# EAGLE design filter2 (EAGLE 7.7.0)
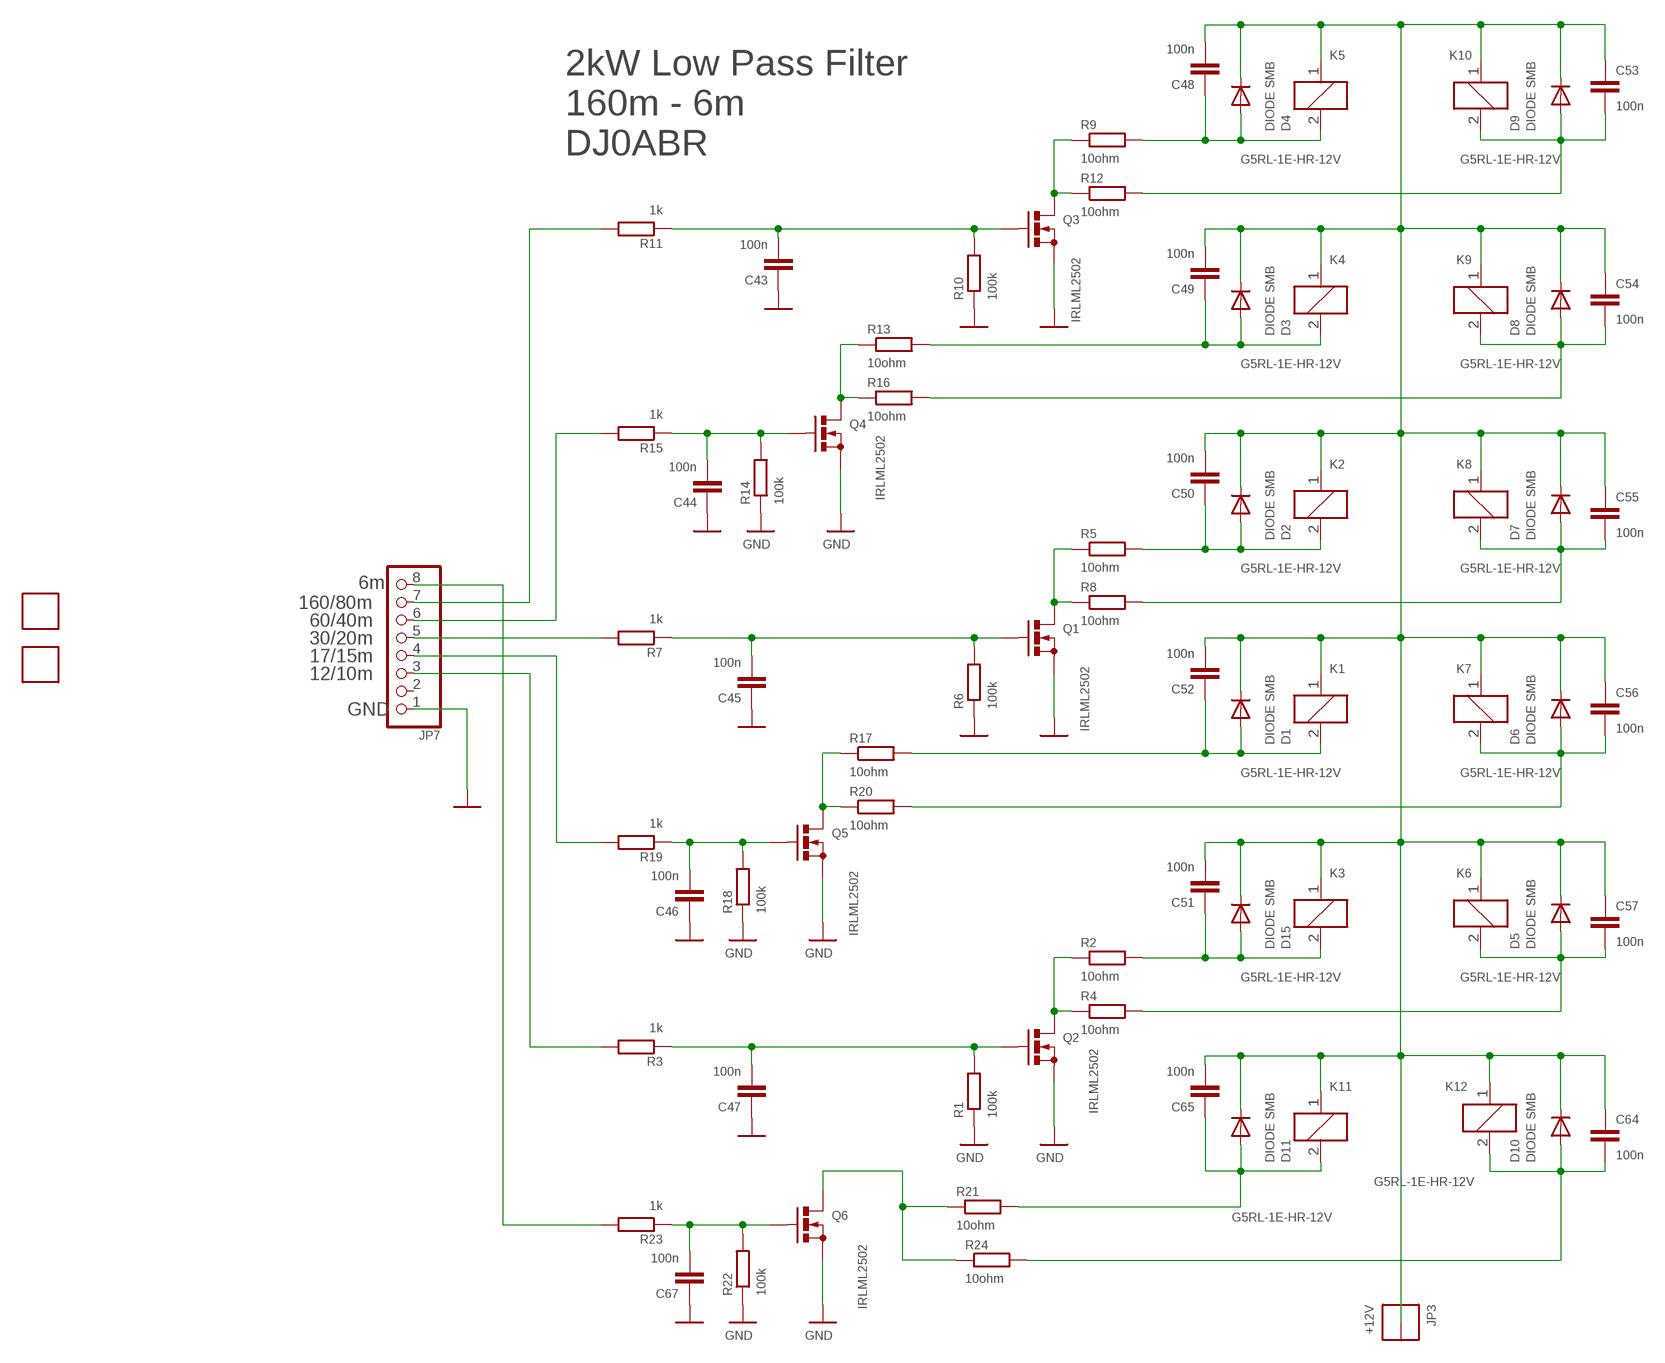
[diagram p0: schematic, sheet 1, part 1 of 2]
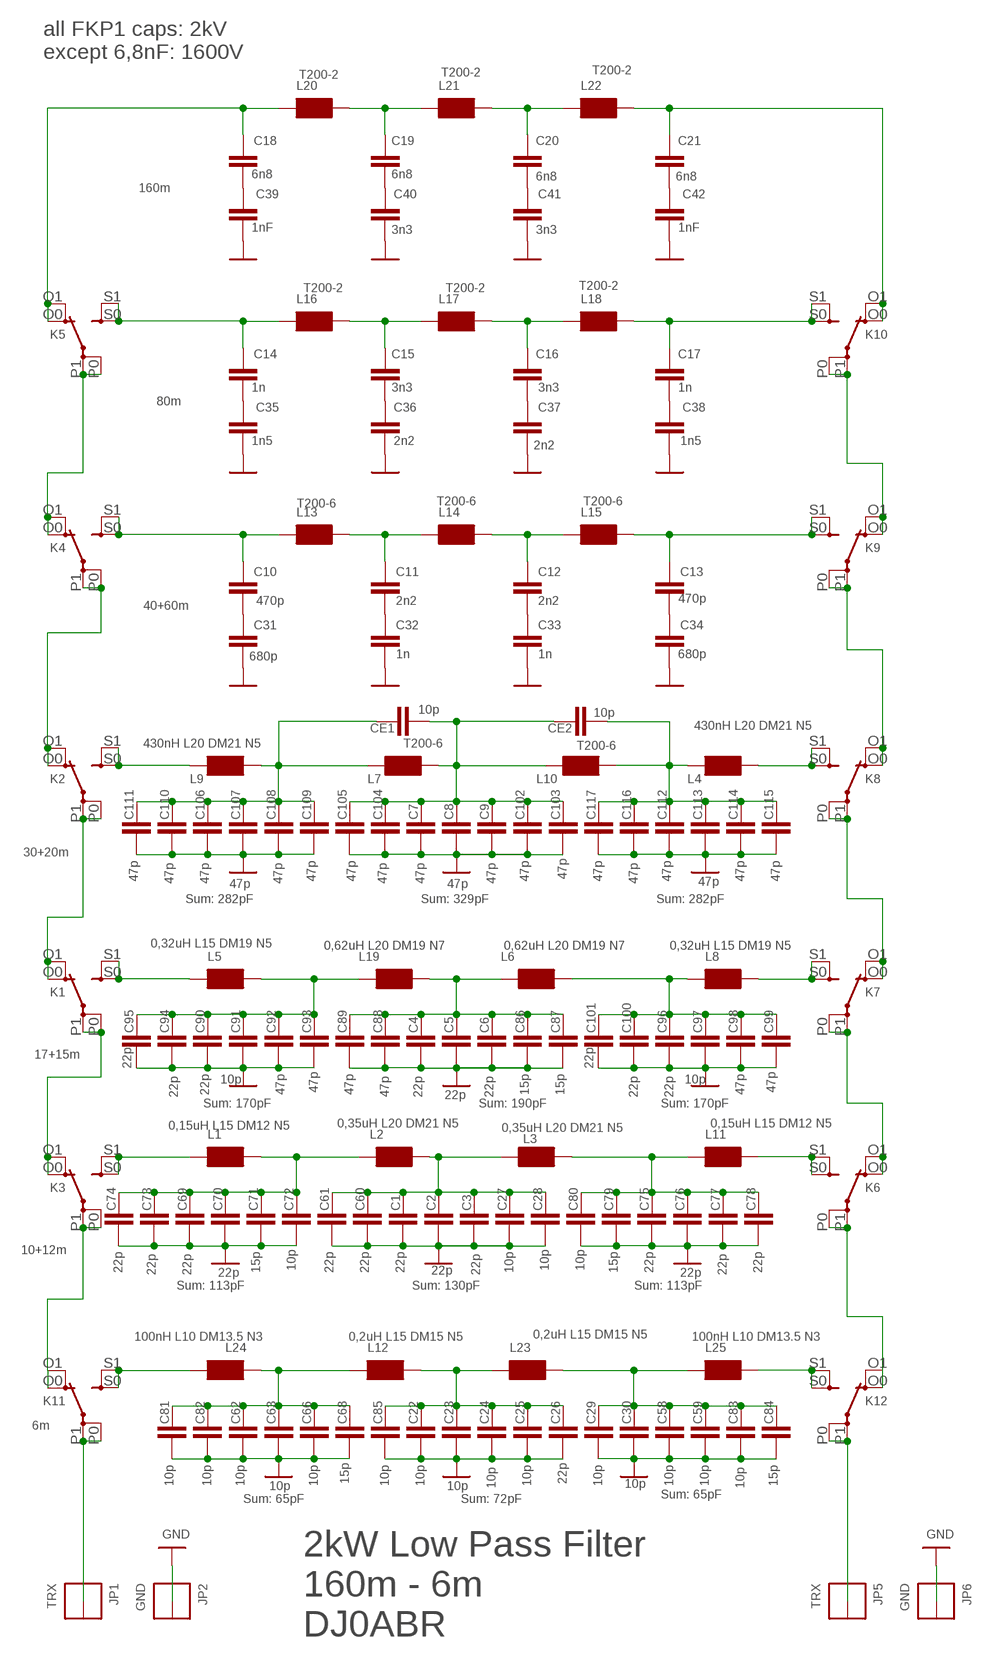
[diagram p1: schematic, sheet 1, part 2 of 2]

## Parts
C1  22p  C-EUC1812K  [C1812K]
C2  22p  C-EUC1812K  [C1812K]
C3  22p  C-EUC1812K  [C1812K]
C4  22p  C-EUC1812K  [C1812K]
C5  22p  C-EUC1812K  [C1812K]
C6  22p  C-EUC1812K  [C1812K]
C7  47p  C-EUC1812K  [C1812K]
C8  47p  C-EUC1812K  [C1812K]
C9  47p  C-EUC1812K  [C1812K]
C10  470p  C-EU150-064X183  [C150-064X183]
C11  2n2  C-EU225-074X268  [C225-074X268]
C12  2n2  C-EU225-074X268  [C225-074X268]
C13  470p  C-EU150-064X183  [C150-064X183]
C14  1n  C-EU225-062X268  [C225-062X268]
C15  3n3  C-EU225-074X268  [C225-074X268]
C16  3n3  C-EU225-074X268  [C225-074X268]
C17  1n  C-EU225-062X268  [C225-062X268]
C18  6n8  C-EU225-074X268  [C225-074X268]
C19  6n8  C-EU225-074X268  [C225-074X268]
C20  6n8  C-EU225-074X268  [C225-074X268]
C21  6n8  C-EU225-074X268  [C225-074X268]
C22  10p  C-EUC1812K  [C1812K]
C23  10p  C-EUC1812K  [C1812K]
C24  10p  C-EUC1812K  [C1812K]
C25  10p  C-EUC1812K  [C1812K]
C26  22p  C-EUC1812K  [C1812K]
C27  10p  C-EUC1812K  [C1812K]
C28  10p  C-EUC1812K  [C1812K]
C29  10p  C-EUC1812K  [C1812K]
C30  10p  C-EUC1812K  [C1812K]
C31  680p  C-EU150-064X183  [C150-064X183]
C32  1n  C-EU225-062X268  [C225-062X268]
C33  1n  C-EU225-062X268  [C225-062X268]
C34  680p  C-EU150-064X183  [C150-064X183]
C35  1n5  C-EU225-074X268  [C225-074X268]
C36  2n2  C-EU225-074X268  [C225-074X268]
C37  2n2  C-EU225-074X268  [C225-074X268]
C38  1n5  C-EU225-074X268  [C225-074X268]
C39  1nF  C-EU225-074X268  [C225-074X268]
C40  3n3  C-EU225-087X268  [C225-087X268]
C41  3n3  C-EU225-087X268  [C225-087X268]
C42  1nF  C-EU225-074X268  [C225-074X268]
C43  100n  C-EUC0603K  [C0603K]
C44  100n  C-EUC0603K  [C0603K]
C45  100n  C-EUC0603K  [C0603K]
C46  100n  C-EUC0603K  [C0603K]
C47  100n  C-EUC0603K  [C0603K]
C48  100n  C-EUC0603K  [C0603K]
C49  100n  C-EUC0603K  [C0603K]
C50  100n  C-EUC0603K  [C0603K]
C51  100n  C-EUC0603K  [C0603K]
C52  100n  C-EUC0603K  [C0603K]
C53  100n  C-EUC0603K  [C0603K]
C54  100n  C-EUC0603K  [C0603K]
C55  100n  C-EUC0603K  [C0603K]
C56  100n  C-EUC0603K  [C0603K]
C57  100n  C-EUC0603K  [C0603K]
C58  10p  C-EUC1812K  [C1812K]
C59  10p  C-EUC1812K  [C1812K]
C60  22p  C-EUC1812K  [C1812K]
C61  22p  C-EUC1812K  [C1812K]
C62  10p  C-EUC1812K  [C1812K]
C63  10p  C-EUC1812K  [C1812K]
C64  100n  C-EUC0603K  [C0603K]
C65  100n  C-EUC0603K  [C0603K]
C66  10p  C-EUC1812K  [C1812K]
C67  100n  C-EUC0603K  [C0603K]
C68  15p  C-EUC1812K  [C1812K]
C69  22p  C-EUC1812K  [C1812K]
C70  22p  C-EUC1812K  [C1812K]
C71  15p  C-EUC1812K  [C1812K]
C72  10p  C-EUC1812K  [C1812K]
C73  22p  C-EUC1812K  [C1812K]
C74  22p  C-EUC1812K  [C1812K]
C75  22p  C-EUC1812K  [C1812K]
C76  22p  C-EUC1812K  [C1812K]
C77  22p  C-EUC1812K  [C1812K]
C78  22p  C-EUC1812K  [C1812K]
C79  15p  C-EUC1812K  [C1812K]
C80  10p  C-EUC1812K  [C1812K]
C81  10p  C-EUC1812K  [C1812K]
C82  10p  C-EUC1812K  [C1812K]
C83  10p  C-EUC1812K  [C1812K]
C84  15p  C-EUC1812K  [C1812K]
C85  10p  C-EUC1812K  [C1812K]
C86  15p  C-EUC1812K  [C1812K]
C87  15p  C-EUC1812K  [C1812K]
C88  47p  C-EUC1812K  [C1812K]
C89  47p  C-EUC1812K  [C1812K]
C90  22p  C-EUC1812K  [C1812K]
C91  10p  C-EUC1812K  [C1812K]
C92  47p  C-EUC1812K  [C1812K]
C93  47p  C-EUC1812K  [C1812K]
C94  22p  C-EUC1812K  [C1812K]
C95  22p  C-EUC1812K  [C1812K]
C96  22p  C-EUC1812K  [C1812K]
C97  10p  C-EUC1812K  [C1812K]
C98  47p  C-EUC1812K  [C1812K]
C99  47p  C-EUC1812K  [C1812K]
C100  22p  C-EUC1812K  [C1812K]
C101  22p  C-EUC1812K  [C1812K]
C102  47p  C-EUC1812K  [C1812K]
C103  47p  C-EUC1812K  [C1812K]
C104  47p  C-EUC1812K  [C1812K]
C105  47p  C-EUC1812K  [C1812K]
C106  47p  C-EUC1812K  [C1812K]
C107  47p  C-EUC1812K  [C1812K]
C108  47p  C-EUC1812K  [C1812K]
C109  47p  C-EUC1812K  [C1812K]
C110  47p  C-EUC1812K  [C1812K]
C111  47p  C-EUC1812K  [C1812K]
C112  47p  C-EUC1812K  [C1812K]
C113  47p  C-EUC1812K  [C1812K]
C114  47p  C-EUC1812K  [C1812K]
C115  47p  C-EUC1812K  [C1812K]
C116  47p  C-EUC1812K  [C1812K]
C117  47p  C-EUC1812K  [C1812K]
CE1  10p  C-EUC1812K  [C1812K]
CE2  10p  C-EUC1812K  [C1812K]
D1  DIODE SMB  DIODE-SMB  [SMB]
D2  DIODE SMB  DIODE-SMB  [SMB]
D3  DIODE SMB  DIODE-SMB  [SMB]
D4  DIODE SMB  DIODE-SMB  [SMB]
D5  DIODE SMB  DIODE-SMB  [SMB]
D6  DIODE SMB  DIODE-SMB  [SMB]
D7  DIODE SMB  DIODE-SMB  [SMB]
D8  DIODE SMB  DIODE-SMB  [SMB]
D9  DIODE SMB  DIODE-SMB  [SMB]
D10  DIODE SMB  DIODE-SMB  [SMB]
D11  DIODE SMB  DIODE-SMB  [SMB]
D15  DIODE SMB  DIODE-SMB  [SMB]
FID1  FIDUCIAL  [FIDUCIAL]
FID2  FIDUCIAL  [FIDUCIAL]
JP1  TRX  THICKPINSQUARE  [THICKPIN]
JP2  GND  THICKPINSQUARE  [THICKPIN]
JP3  +12V  THICKPINSQUARE  [THICKPIN]
JP5  TRX  THICKPINSQUARE  [THICKPIN]
JP6  GND  THICKPINSQUARE  [THICKPIN]
JP7  PINHD-1X8  [1X08]
K1  G5RL-1E-HR-12V  G2RE  [G2RE]
K2  G5RL-1E-HR-12V  G2RE  [G2RE]
K3  G5RL-1E-HR-12V  G2RE  [G2RE]
K4  G5RL-1E-HR-12V  G2RE  [G2RE]
K5  G5RL-1E-HR-12V  G2RE  [G2RE]
K6  G5RL-1E-HR-12V  G2RE  [G2RE]
K7  G5RL-1E-HR-12V  G2RE  [G2RE]
K8  G5RL-1E-HR-12V  G2RE  [G2RE]
K9  G5RL-1E-HR-12V  G2RE  [G2RE]
K10  G5RL-1E-HR-12V  G2RE  [G2RE]
K11  G5RL-1E-HR-12V  G2RE  [G2RE]
K12  G5RL-1E-HR-12V  G2RE  [G2RE]
L1  0,15uH L15 DM12 N5  LL15X14  [LUFTSPULE_L15XDM14]
L2  0,35uH L20 DM21 N5  LL17X20  [LUFTSPULE_L17XDM20]
L3  0,35uH L20 DM21 N5  LL17X20  [LUFTSPULE_L17XDM20]
L4  430nH L20 DM21 N5  L20X20  [LUFTSPULE_20X20RM20]
L5  0,32uH L15 DM19 N5  LL15X20  [LUFTSPULR_L15XDM20]
L6  0,62uH L20 DM19 N7  L20X20  [LUFTSPULE_20X20RM20]
L7  T200-6  LT200  [KERN200_STEHEND_2PIN]
L8  0,32uH L15 DM19 N5  LL15X20  [LUFTSPULR_L15XDM20]
L9  430nH L20 DM21 N5  L20X20  [LUFTSPULE_20X20RM20]
L10  T200-6  LT200  [KERN200_STEHEND_2PIN]
L11  0,15uH L15 DM12 N5  LL15X14  [LUFTSPULE_L15XDM14]
L12  0,2uH L15 DM15 N5  LL15X14  [LUFTSPULE_L15XDM14]
L13  T200-6  LT200  [KERN200_STEHEND_2PIN]
L14  T200-6  LT200  [KERN200_STEHEND_2PIN]
L15  T200-6  LT200  [KERN200_STEHEND_2PIN]
L16  T200-2  LT200  [KERN200_STEHEND_2PIN]
L17  T200-2  LT200  [KERN200_STEHEND_2PIN]
L18  T200-2  LT200  [KERN200_STEHEND_2PIN]
L19  0,62uH L20 DM19 N7  L20X20  [LUFTSPULE_20X20RM20]
L20  T200-2  LT200  [KERN200_STEHEND_2PIN]
L21  T200-2  LT200  [KERN200_STEHEND_2PIN]
L22  T200-2  LT200  [KERN200_STEHEND_2PIN]
L23  0,2uH L15 DM15 N5  LL15X14  [LUFTSPULE_L15XDM14]
L24  100nH L10 DM13.5 N3  L  [LUFTSPULE_10X13K5]
L25  100nH L10 DM13.5 N3  L  [LUFTSPULE_10X13K5]
Q1  IRLML2502  BS170_SMD  [SOT23]
Q2  IRLML2502  BS170_SMD  [SOT23]
Q3  IRLML2502  BS170_SMD  [SOT23]
Q4  IRLML2502  BS170_SMD  [SOT23]
Q5  IRLML2502  BS170_SMD  [SOT23]
Q6  IRLML2502  BS170_SMD  [SOT23]
R1  100k  R-EU_R0603  [R0603]
R2  10ohm  R-EU_R0603  [R0603]
R3  1k  R-EU_R0603  [R0603]
R4  10ohm  R-EU_R0603  [R0603]
R5  10ohm  R-EU_R0603  [R0603]
R6  100k  R-EU_R0603  [R0603]
R7  1k  R-EU_R0603  [R0603]
R8  10ohm  R-EU_R0603  [R0603]
R9  10ohm  R-EU_R0603  [R0603]
R10  100k  R-EU_R0603  [R0603]
R11  1k  R-EU_R0603  [R0603]
R12  10ohm  R-EU_R0603  [R0603]
R13  10ohm  R-EU_R0603  [R0603]
R14  100k  R-EU_R0603  [R0603]
R15  1k  R-EU_R0603  [R0603]
R16  10ohm  R-EU_R0603  [R0603]
R17  10ohm  R-EU_R0603  [R0603]
R18  100k  R-EU_R0603  [R0603]
R19  1k  R-EU_R0603  [R0603]
R20  10ohm  R-EU_R0603  [R0603]
R21  10ohm  R-EU_R0603  [R0603]
R22  100k  R-EU_R0603  [R0603]
R23  1k  R-EU_R0603  [R0603]
R24  10ohm  R-EU_R0603  [R0603]

## Nets
+12V [ub]: C48.2 C49.2 C50.2 C51.2 C52.2 C53.1 C54.1 C55.1 C56.1 C57.1 C64.1 C65.2 D1.C D2.C D3.C D4.C D5.C D6.C D7.C D8.C D9.C D10.C D11.C D15.C JP3.1 K1.1 K2.1 K3.1 K4.1 K5.1 K6.1 K7.1 K8.1 K9.1 K10.1 K11.1 K12.1
GND: C1.2 C2.2 C3.2 C4.2 C5.2 C6.2 C7.2 C8.2 C9.2 C22.2 C23.2 C24.2 C25.2 C26.2 C27.2 C28.2 C29.2 C30.2 C31.2 C32.2 C33.2 C34.2 C35.2 C36.2 C37.2 C38.2 C39.2 C40.2 C41.2 C42.2 C43.1 C44.1 C45.1 C46.1 C47.1 C58.2 C59.2 C60.2 C61.2 C62.2 C63.2 C66.2 C67.1 C68.2 C69.2 C70.2 C71.2 C72.2 C73.2 C74.2 C75.2 C76.2 C77.2 C78.2 C79.2 C80.2 C81.2 C82.2 C83.2 C84.2 C85.2 C86.2 C87.2 C88.2 C89.2 C90.2 C91.2 C92.2 C93.2 C94.2 C95.2 C96.2 C97.2 C98.2 C99.2 C100.2 C101.2 C102.2 C103.2 C104.2 C105.2 C106.2 C107.2 C108.2 C109.2 C110.2 C111.2 C112.2 C113.2 C114.2 C115.2 C116.2 C117.2 JP2.1 JP6.1 JP7.1 Q1.2(S) Q2.2(S) Q3.2(S) Q4.2(S) Q5.2(S) Q6.2(S) R1.1 R6.1 R10.1 R14.1 R18.1 R22.1 ; supply symbol labelled 
N$1: K6.P0(2:P) K6.P1(2:P) K12.O0(2:O) K12.O1(2:O)
N$2: K3.S0(2:S) K3.S1(2:S) L1.P$1
N$3: K1.P0(2:P) K1.P1(2:P) K3.O0(2:O) K3.O1(2:O)
N$4: C75.1 C76.1 C77.1 C78.1 C79.1 C80.1 L3.P$2 L11.P$1
N$5: K1.S0(2:S) K1.S1(2:S) L5.P$1
N$6: K1.O0(2:O) K1.O1(2:O) K2.P0(2:P) K2.P1(2:P)
N$7: C1.1 C2.1 C3.1 C27.1 C28.1 C60.1 C61.1 L2.P$2 L3.P$1
N$8: K2.S0(2:S) K2.S1(2:S) L9.P$1
N$9: K2.O0(2:O) K2.O1(2:O) K4.P0(2:P) K4.P1(2:P)
N$10: K8.S0(2:S) K8.S1(2:S) L4.P$2
N$11: K4.O0(2:O) K4.O1(2:O) K5.P0(2:P) K5.P1(2:P)
N$12: C106.1 C107.1 C108.1 C109.1 C110.1 C111.1 CE1.1 L7.1 L9.P$2
N$13: K7.S0(2:S) K7.S1(2:S) L8.P$2
N$14: Q2.3(D) R2.1 R4.1
N$15: K6.S0(2:S) K6.S1(2:S) L11.P$2
N$17: K6.O0(2:O) K6.O1(2:O) K7.P0(2:P) K7.P1(2:P)
N$18: K7.O0(2:O) K7.O1(2:O) K8.P0(2:P) K8.P1(2:P)
N$19: K8.O0(2:O) K8.O1(2:O) K9.P0(2:P) K9.P1(2:P)
N$20: K9.O0(2:O) K9.O1(2:O) K10.P0(2:P) K10.P1(2:P)
N$21: C47.2 Q2.1(G) R1.2 R3.1
N$22: C90.1 C91.1 C92.1 C93.1 C94.1 C95.1 L5.P$2 L19.P$1
N$23: C4.1 C5.1 C6.1 C86.1 C87.1 C88.1 C89.1 L6.P$1 L19.P$2
N$24: C96.1 C97.1 C98.1 C99.1 C100.1 C101.1 L6.P$2 L8.P$1
N$25: C18.1 K5.O0(2:O) K5.O1(2:O) L20.1
N$26: C7.1 C8.1 C9.1 C102.1 C103.1 C104.1 C105.1 CE1.2 CE2.1 L7.2 L10.1
N$27: C112.1 C113.1 C114.1 C115.1 C116.1 C117.1 CE2.2 L4.P$1 L10.2
N$28: C10.1 K4.S0(2:S) K4.S1(2:S) L13.1
N$29: C11.1 L13.2 L14.1
N$30: C12.1 L14.2 L15.1
N$31: C13.1 K9.S0(2:S) K9.S1(2:S) L15.2
N$32: C14.1 K5.S0(2:S) K5.S1(2:S) L16.1
N$33: C15.1 L16.2 L17.1
N$34: C16.1 L17.2 L18.1
N$35: C17.1 K10.S0(2:S) K10.S1(2:S) L18.2
N$36: K3.P0(2:P) K3.P1(2:P) K11.O0(2:O) K11.O1(2:O)
N$37: C19.1 L20.2 L21.1
N$38: C20.1 L21.2 L22.1
N$40: Q1.3(D) R5.1 R8.1
N$41: C45.2 Q1.1(G) R6.2 R7.1
N$42: Q3.3(D) R9.1 R12.1
N$43: C43.2 Q3.1(G) R10.2 R11.1
N$44: Q4.3(D) R13.1 R16.1
N$45: C44.2 Q4.1(G) R14.2 R15.1
N$46: Q5.3(D) R17.1 R20.1
N$47: C46.2 Q5.1(G) R18.2 R19.1
N$48: JP7.5 R7.2
N$49: JP7.6 R15.2
N$50: JP7.7 R11.2
N$51: C22.1 C23.1 C24.1 C25.1 C26.1 C85.1 L12.P$2 L23.P$1
N$52: C21.1 K10.O0(2:O) K10.O1(2:O) L22.2
N$53: C69.1 C70.1 C71.1 C72.1 C73.1 C74.1 L1.P$2 L2.P$1
N$54: C13.2 C34.1
N$55: C21.2 C42.1
N$56: C20.2 C41.1
N$57: C19.2 C40.1
N$58: C18.2 C39.1
N$61: C10.2 C31.1
N$62: C11.2 C32.1
N$63: C12.2 C33.1
N$64: C17.2 C38.1
N$65: C16.2 C37.1
N$66: C15.2 C36.1
N$67: C14.2 C35.1
N$72: JP7.4 R19.2
N$73: JP7.3 R3.2
N$74: JP1.1 K11.P0(2:P) K11.P1(2:P)
N$75: K11.S0(2:S) K11.S1(2:S) L24.P$1
N$76: Q6.3(D) R21.1 R24.1
N$77: C62.1 C63.1 C66.1 C68.1 C81.1 C82.1 L12.P$1 L24.P$2
N$79: C29.1 C30.1 C58.1 C59.1 C83.1 C84.1 L23.P$2 L25.P$1
N$80: K12.S0(2:S) K12.S1(2:S) L25.P$2
N$81: JP5.1 K12.P0(2:P) K12.P1(2:P)
N$82: C67.2 Q6.1(G) R22.2 R23.1
N$86: JP7.8 R23.2
R1: C50.1 D2.A K2.2 R5.2
R2: C51.1 D15.A K3.2 R2.2
R3: C52.1 D1.A K1.2 R17.2
R4: C65.1 D11.A K11.2 R21.2
R5: C49.1 D3.A K4.2 R13.2
R8: C48.1 D4.A K5.2 R9.2
RB6: C64.2 D10.A K12.2 R24.2
RB10: C57.2 D5.A K6.2 R4.2
RB15: C56.2 D6.A K7.2 R20.2
RB20: C55.2 D7.A K8.2 R8.2
RB40: C54.2 D8.A K9.2 R16.2
RB80: C53.2 D9.A K10.2 R12.2
Unconnected: FID1.P$1 FID2.P$1 JP7.2

## Notes on the sheet
- all FKP1 caps: 2kV
  except 6,8nF: 1600V
- 160m
- 2kW Low Pass Filter
  160m - 6m
  DJ0ABR
- 80m
- 40+60m
- 6m
- 160/80m
- 30+20m
- 60/40m
- 30/20m
- 17/15m | Sum: 282pF | Sum: 329pF | Sum: 282pF
- 12/10m
- GND
- 17+15m
- Sum: 170pF | Sum: 190pF | Sum: 170pF
- 10+12m
- Sum: 113pF | Sum: 130pF | Sum: 113pF
- 6m
- Sum: 65pF
- Sum: 65pF | Sum: 72pF
- 2kW Low Pass Filter
  160m - 6m
  DJ0ABR

## Library data of the parts
C1-C117 CE1 CE2 = rcl:C-EU: CAPACITOR, European symbol
D1-D11 D15 = diode:DIODE-: DIODE
FID1 FID2 = km:FIDUCIAL
JP1-JP3 JP5 JP6 = km:THICKPIN
JP7 = pinhead:PINHD-1X8: PIN HEADER
K1-K12 = relay:G2RE: RELAY 1 x switch, high current, Omron; OC_FARNELL: unknown; OC_NEWARK: unknown
L1-L25 = km_HF:L
Q1-Q6 = km:BS170_: N-CHANNEL MOS FET
R1-R24 = rcl:R-EU_: RESISTOR, European symbol

## Net classes
1 ub: width 0.61 mm

## Board
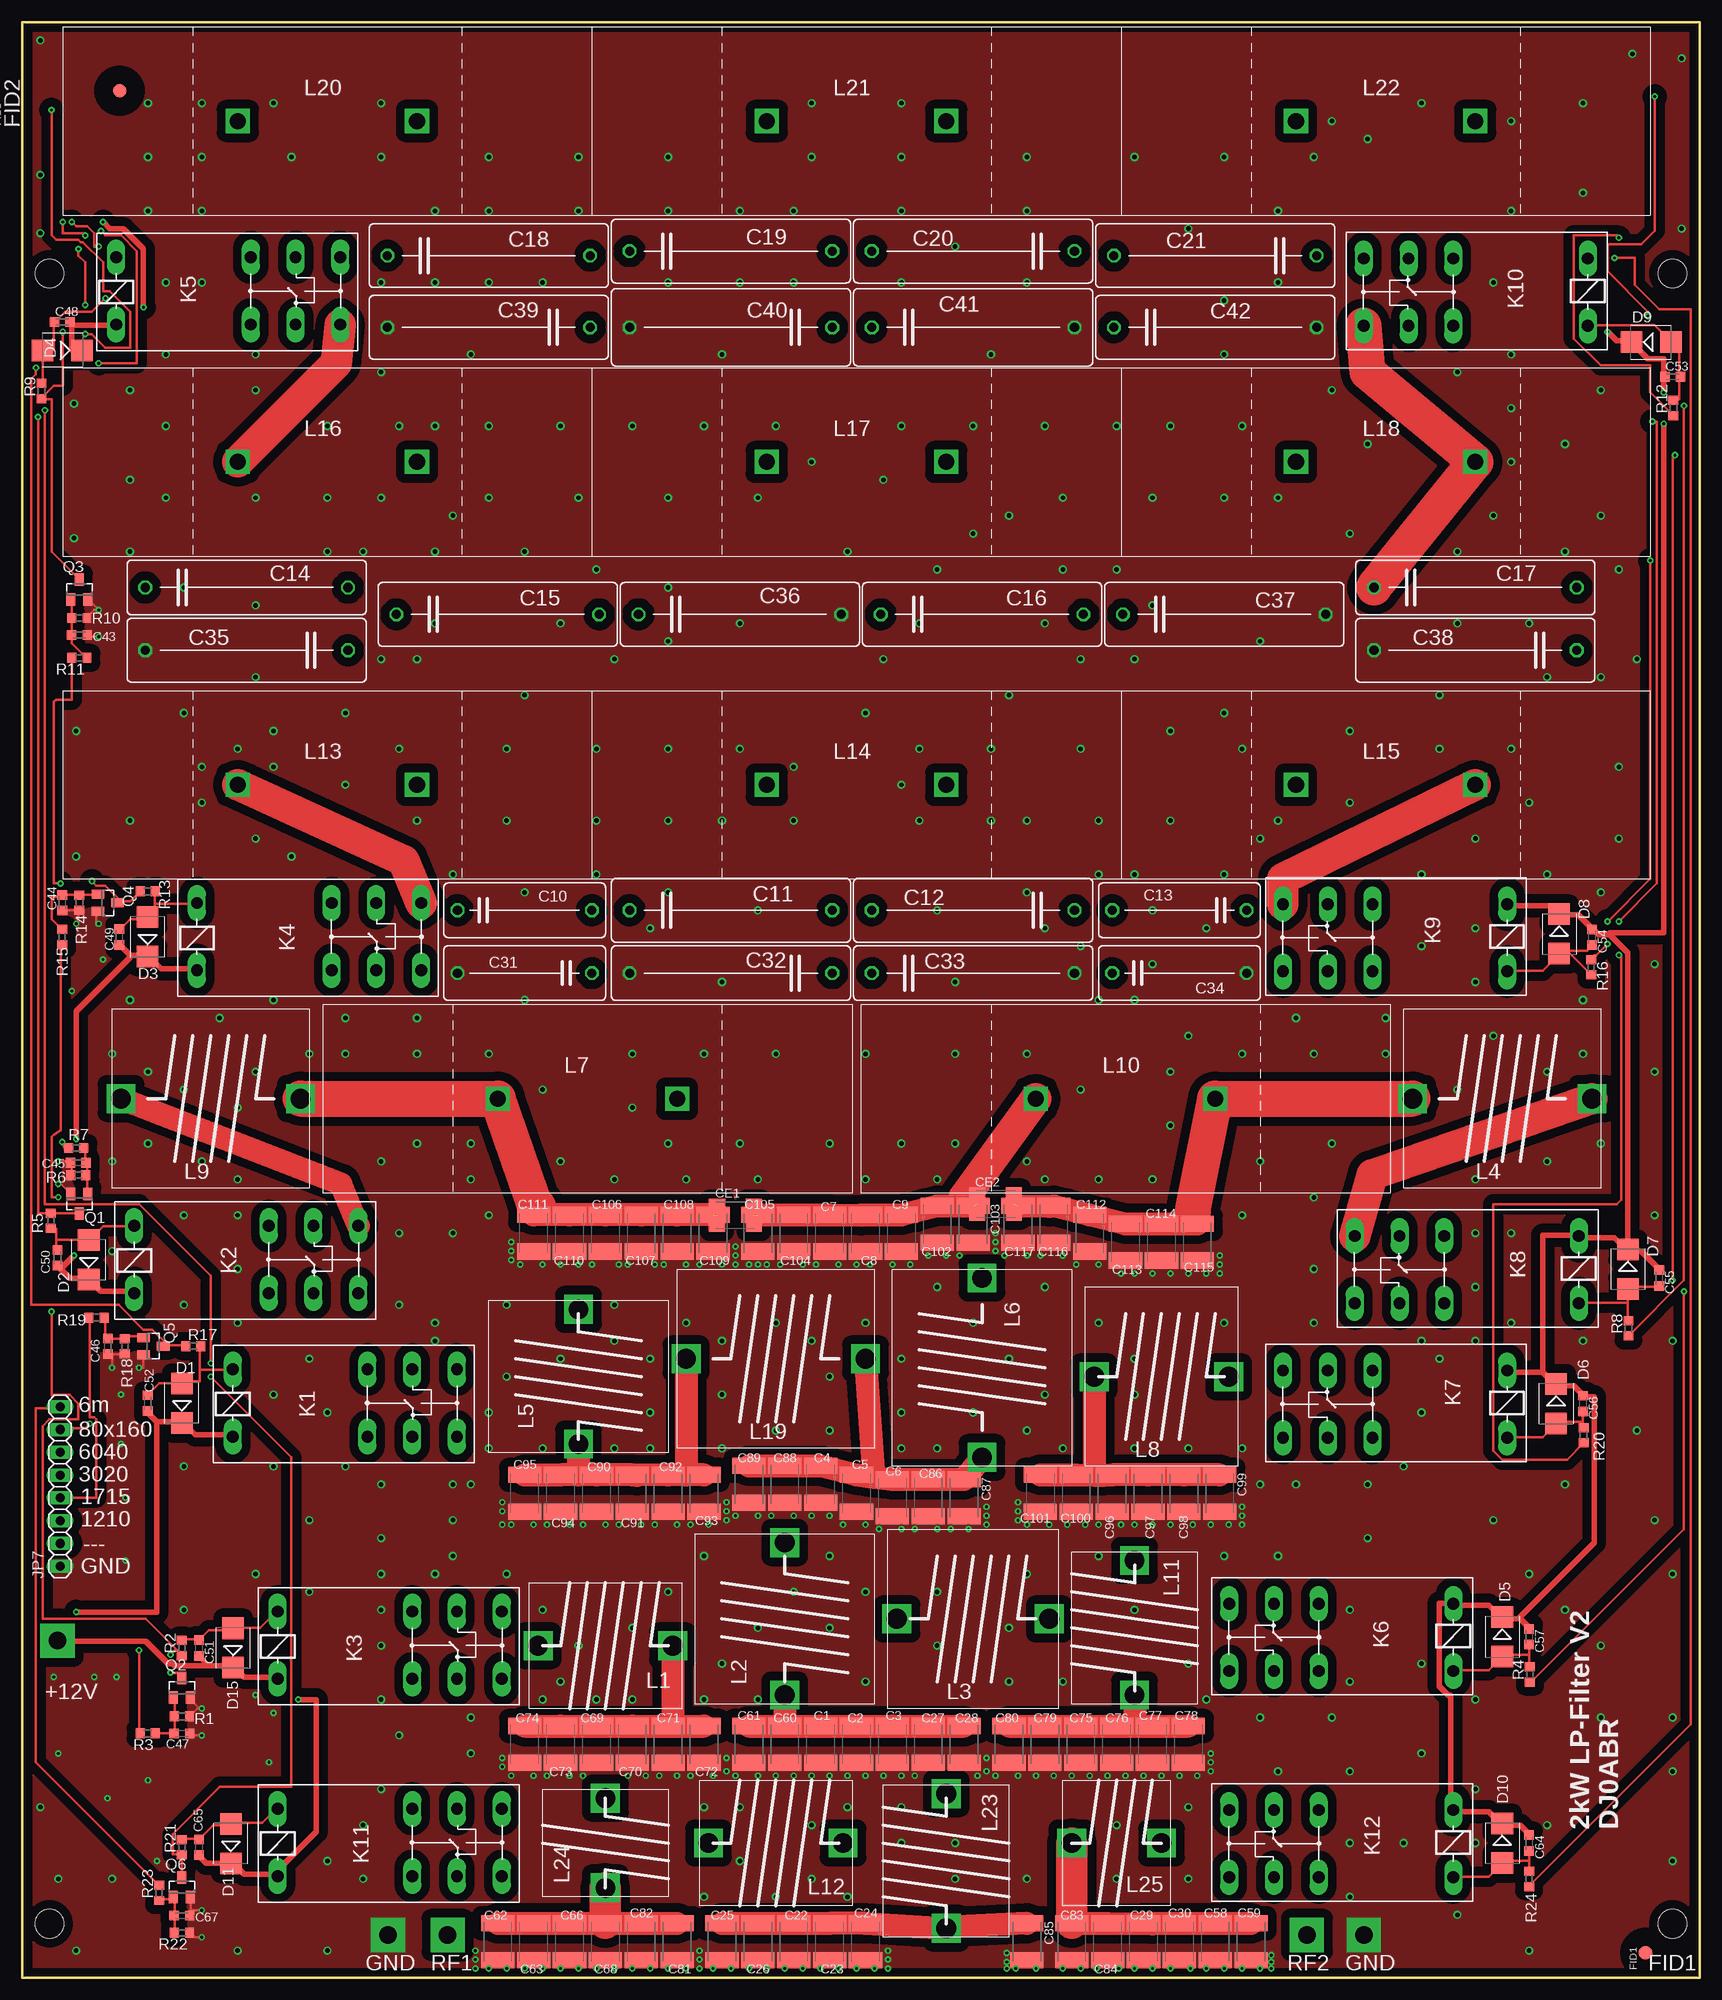
[diagram p2: board, top side]
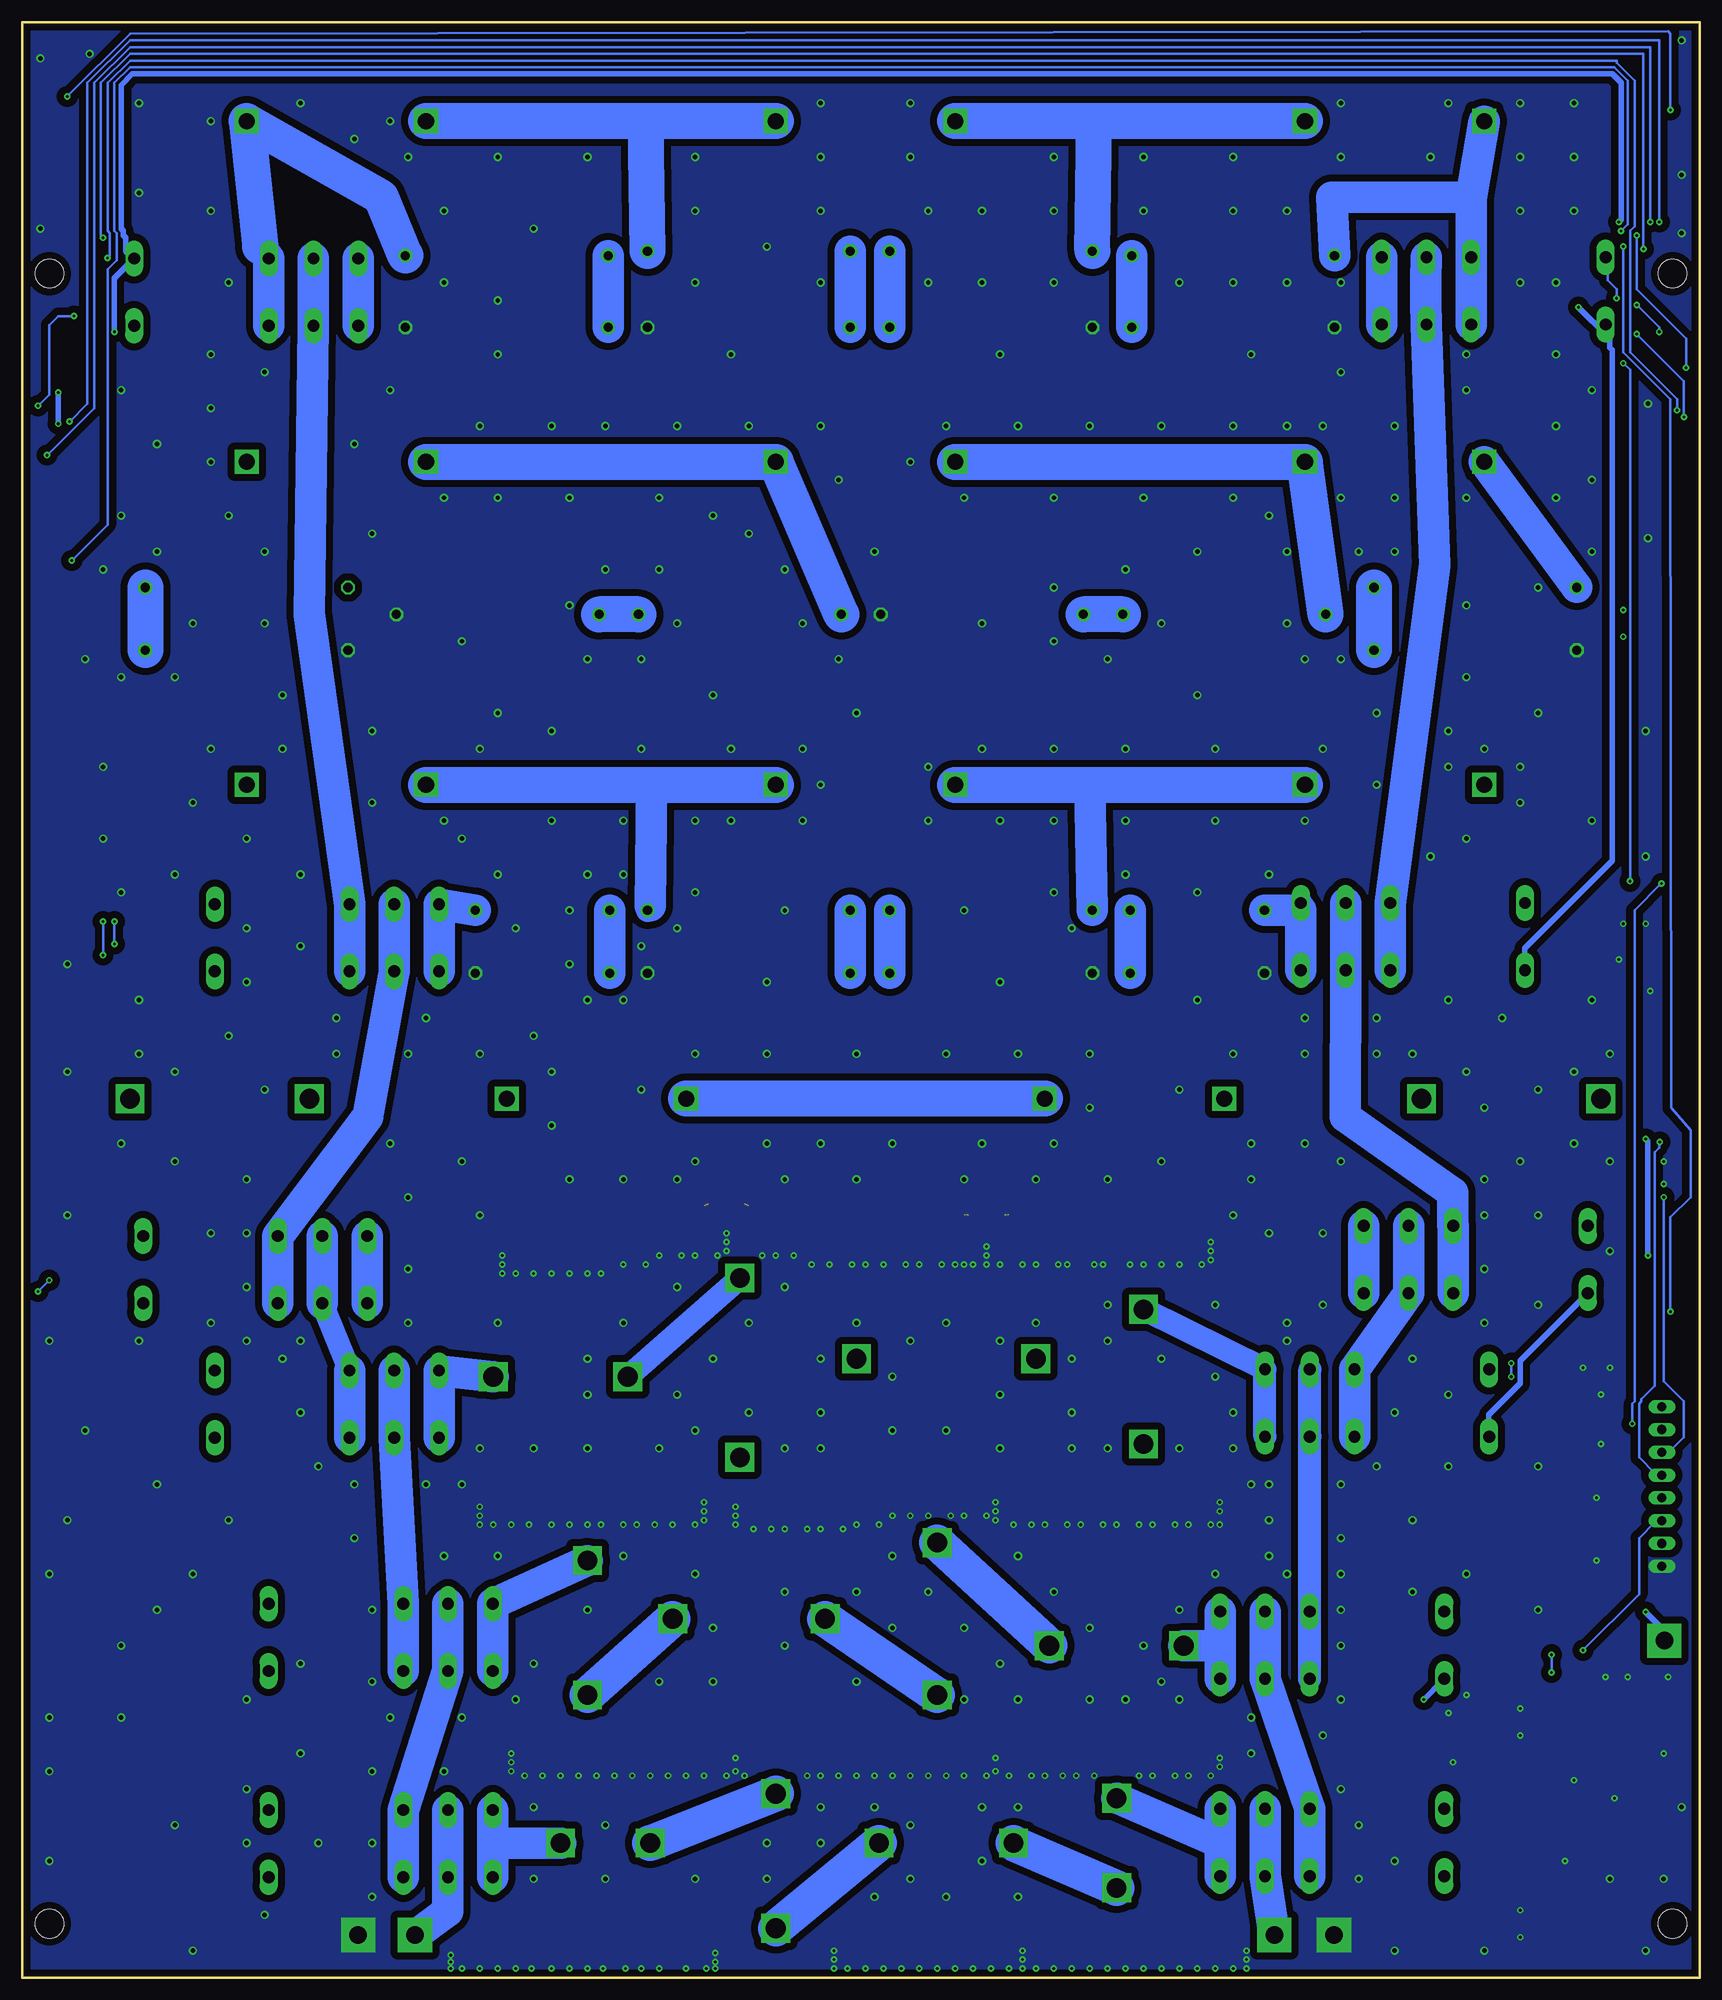
[diagram p3: board, bottom side, seen from below]

Size 187 x 218 mm. Coordinates in mm from the lower left corner, seen from the top.
Outline: 0,0 187,0 187,218 0,218 0,0
Copper layers (1*16): Top 0.035mm / dielectric 1.5mm / Bottom 0.035mm
Design rules "default *": minimum track width 12mil, minimum drill 0.3mm, track to track 8mil, track to pad 8mil, pad to pad 8mil, via to via 8mil, smd to smd 0mil, copper to edge 10mil, drill to drill 8mil, minimum pad ring 10mil, minimum via ring 8mil, stop-mask expansion 4mil, vias tented up to drill 0.51mm, thermal gap 10mil
Holes 3.2 mm at 3,190 184,190 3,6 184,6

### Footprints (pad centres in the part's own frame; a part is rotated, then mirrored left to right if it is on the bottom)
C1812K = smd 1.8 x 3.7: 1 -2.05,0; 2 2.05,0
C150-064X183 = drill 1.016 octagon: 1 -7.493,0; 2 7.493,0
C225-074X268 = drill 1.016 octagon: 1 -11.303,0; 2 11.303,0
C225-062X268 = drill 1.016 octagon: 1 -11.303,0; 2 11.303,0
C225-087X268 = drill 1.016 octagon: 1 -11.303,0; 2 11.303,0
C0603K = smd 1.05 x 1.08: 1 -0.875,0; 2 0.875,0
SMB = smd 2.4 x 2.4: A 2.2,0; C -2.2,0
FIDUCIAL = smd 1.5 x 1.5: P$1 0,0
THICKPIN = drill 1.93 pad 3.81 square: 1 0,0
1X08 = drill 1.016 long: 1 -8.89,0; 2 -6.35,0; 3 -3.81,0; 4 -1.27,0; 5 1.27,0; 6 3.81,0; 7 6.35,0; 8 8.89,0
G2RE = drill 1.321 long: 1 -2.54,-3.683; 2 -2.54,3.81; O0 12.471,-3.683; O1 12.471,3.81; P0 17.45,-3.683; P1 17.45,3.81; S0 22.454,-3.683; S1 22.454,3.81
LUFTSPULE_L15XDM14 = drill 2.2 square: P$1 -7.5,0; P$2 7.5,0
LUFTSPULE_L17XDM20 = drill 2.2 square: P$1 -8.5,0; P$2 8.5,0
LUFTSPULE_20X20RM20 = drill 2.2 square: P$1 -10,0; P$2 10,0
LUFTSPULR_L15XDM20 = drill 2.2 square: P$1 -7.5,0; P$2 7.5,0
KERN200_STEHEND_2PIN = drill 1.8 square: 1 -10,0; 2 10,0
LUFTSPULE_10X13K5 = drill 2.2 square: P$1 -5,0; P$2 5,0
SOT23 = smd 1 x 1.4: 1 -0.95,-1.1; 2 0.95,-1.1; 3 0,1.1
R0603 = smd 1 x 1.1: 1 -0.85,0; 2 0.85,0

### Placement (x,y rotation side)
C1  89,26 270 top
C2  93,26 270 top
C3  97,26 270 top
C4  89,55 270 top
C5  93,54 270 top
C6  97,53.5 270 top
C7  90,83 270 top
C8  94,83 270 top
C9  98,83 270 top
C10  56,119 0 top
C11  79,119 0 top
C12  106,119 180 top
C13  129,119 180 top
C14  25,155 0 top
C15  53,152 0 top
C16  107,152 0 top
C17  162,155 0 top
C18  52,192 0 top
C19  79,192.5 0 top
C20  106,192.5 180 top
C21  133,192 180 top
C22  86,4 270 top
C23  90,4 270 top
C24  94,4 270 top
C25  78,4 270 top
C26  82,4 270 top
C27  101,26 270 top
C28  105,26 270 top
C29  125,4 270 top
C30  129,4 270 top
C31  56,112 180 top
C32  79,112 180 top
C33  106,112 0 top
C34  129,112 0 top
C35  25,148 180 top
C36  80,152 0 top
C37  134,152 0 top
C38  162,148 180 top
C39  52,184 180 top
C40  79,184 180 top
C41  106,184 0 top
C42  133,184 0 top
C43  6.35,149.69 180 top
C44  4.45,119.84 90 top
C45  6.21,90.86 0 top
C46  9.53,70.41 90 top
C47  17.78,27.23 180 top
C48  4.45,184.61 0 top
C49  10.79,116.03 270 top
C50  3.92,80.27 270 top
C51  19.68,36.75 270 top
C52  13.97,64.06 270 top
C53  184,178.5 0 top
C54  175,116 270 top
C55  182.5,78 270 top
C56  174,64 270 top
C57  168,38 270 top
C58  133,4 270 top
C59  137,4 270 top
C60  85,26 270 top
C61  81,26 270 top
C62  53,4 270 top
C63  57,4 270 top
C64  168,15 270 top
C65  19.68,14.53 270 top
C66  61,4 270 top
C67  17.78,6.91 180 top
C68  65,4 270 top
C69  64,26 270 top
C70  68,26 270 top
C71  72,26 270 top
C72  76,26 270 top
C73  60,26 270 top
C74  56,26 270 top
C75  118,26 270 top
C76  122,26 270 top
C77  126,26 270 top
C78  130,26 270 top
C79  114,26 270 top
C80  110,26 270 top
C81  73,4 270 top
C82  69,4 270 top
C83  117,4 270 top
C84  121,4 270 top
C85  112,4 270 top
C86  101,53.5 270 top
C87  105,53.5 270 top
C88  85,55 270 top
C89  81,55 270 top
C90  64,54 270 top
C91  68,54 270 top
C92  72,54 270 top
C93  76,54 270 top
C94  60,54 270 top
C95  56,54 270 top
C96  121.5,54 270 top
C97  125.5,54 270 top
C98  129.5,54 270 top
C99  133.5,54 270 top
C100  117.5,54 270 top
C101  113.5,54 270 top
C102  102,84 270 top
C103  106,84 270 top
C104  86,83 270 top
C105  82,83 270 top
C106  65,83 270 top
C107  69,83 270 top
C108  73,83 270 top
C109  77,83 270 top
C110  61,83 270 top
C111  57,83 270 top
C112  119,83 270 top
C113  123,82 270 top
C114  127,82 270 top
C115  131,82 270 top
C116  115,84 270 top
C117  111,84 270 top
CE1  79.5,85 0 top
CE2  108.5,86.25 0 top
D1  17.78,64.06 90 top
D2  7.39,80.02 90 top
D3  13.97,116.03 90 top
D4  4.45,181.44 180 top
D5  165,38 270 top
D6  171,64 270 top
D7  179,79 270 top
D8  171.34,116.37 270 top
D9  181.59,182.34 0 top
D10  165,15 270 top
D11  23.24,14.94 90 top
D15  23.5,36.75 90 top
FID1  180.97,2.74 90 top
FID2  10.83,210.39 90 top
JP1  47.41,4.74 0 top
JP2  40.76,4.74 0 top
JP3  3.92,37.57 0 top
JP5  143.22,4.74 0 top
JP6  149.57,4.74 0 top
JP7  4.2,54.76 90 top
K1  26,64 0 top
K2  15,80 0 top
K3  31,37 0 top
K4  22,116 0 top
K5  13,188 0 top
K6  157,38 180 top
K7  163,64 180 top
K8  171,79 180 top
K9  163,116 180 top
K10  172,188 180 top
K11  31,15 0 top
K12  157,15 180 top
L1  65,37 0 top
L2  85,40 270 top
L3  106,40 0 top
L4  165,98 0 top
L5  62,67 270 top
L6  107,68 90 top
L7  63,98 0 top
L8  127,67 0 top
L9  21,98 0 top
L10  123,98 0 top
L11  124,39 90 top
L12  84,15 0 top
L13  34,133 0 top
L14  93,133 0 top
L15  152,133 0 top
L16  34,169 0 top
L17  93,169 0 top
L18  152,169 0 top
L19  84,69 0 top
L20  34,207 0 top
L21  93,207 0 top
L22  152,207 0 top
L23  103,13 90 top
L24  65,15 270 top
L25  122,15 0 top
Q1  6.35,86.28 180 top
Q2  17.78,32.3 0 top
Q3  6.35,154.76 0 top
Q4  9.53,119.84 270 top
Q5  14.61,70.41 270 top
Q6  17.78,10.08 0 top
R1  17.78,29.13 180 top
R2  17.78,36.75 90 top
R3  13.97,27.23 180 top
R4  168.08,33.79 90 top
R5  3.17,84.38 270 top
R6  6.21,89.45 0 top
R7  6,92.5 180 top
R8  179.08,72.4 90 top
R9  2.13,176.9 90 top
R10  6.35,151.59 180 top
R11  6.35,147.15 180 top
R12  184.08,175.01 90 top
R13  13.97,121.11 0 top
R14  6.35,119.84 90 top
R15  4.45,116.03 270 top
R16  174.92,112.66 270 top
R17  19.05,70.41 0 top
R18  11.43,70.41 90 top
R19  8.26,73.58 180 top
R20  174.08,60.46 90 top
R21  17.78,14.53 90 top
R22  17.78,5 180 top
R23  15.24,9.45 90 top
R24  168,11 90 top

### Tracks (layer width: path | path; a pad name or v marks a point on that pad's centre or on a via)
+12V  (via drill 0.3)
  Top 0.61: C64.1 168,16 167,17 165,17 D10.C 164.75,17.25 163.5,18.5 159.75,18.5 K12.1 159.25,18.75 159.25,31.5 159,31.5 158,32.5 158,41.75 159.25,41.75 K6.1 159.75,41.5 163.5,41.5 164.75,40.25 D5.C 165,40 167,40 | 167,40 168,39 C57.1 | v176.75,183.5 177.75,182.5 179.25,182.5 D9.C 179.5,182.25 181.25,180.5 183,180.5 183,178.5 C53.1 183,178.25 v183,176.75 | K9.1 165.75,119.5 170.5,119.5 171.25,118.75 D8.C 171.5,118.5 173.5,118.5 175,117 C54.1 175.25,116.75 175.75,116.25 177,116.25 | 169.5,67.5 170.75,66.25 D6.C 171,66 173,66 174,65 C56.1 174.25,64.75 175.25,64.75 175.25,48.5 167,40.25 167,40 | 169.5,67.5 165.75,67.5 K7.1 | C55.1 182.5,79 180.5,81 179,81 D7.C | D7.C 178.75,81.25 177.5,82.5 173.75,82.5 K8.1 173.25,82.75 169.5,82.75 169.5,67.5 | 177,116.25 179,114.25 D7.C | v183,173.25 183,116.5 177,116.5 177,116.25 | D4.C 6.5,181.5 5.5,181.5 5.5,184.5 C48.2 5.75,184.25 10.25,184.25 K5.1 | 12,114 11,115 C49.2 | 12,114 13.75,114 D3.C 14.25,113.75 15.5,112.5 19.25,112.5 K4.1 | K2.1 12.25,76.5 8.75,76.5 7.5,77.75 D2.C 7.25,78 5.25,78 4,79.25 C50.2 4.25,79.25 4.5,79.25 v5.75,80.5 | 15,62 14,63 C52.2 | 15,62 17.75,62 D1.C 18,61.75 19.25,60.5 23.25,60.5 K1.1 | C65.2 19.75,13.5 20.5,12.75 23,12.75 D11.C 23.5,12.75 24.75,11.5 28.25,11.5 K11.1 28.25,11.75 32.75,16.25 32.75,31 v30.75,31 | 20.62,34.88 20.75,34.75 23.25,34.75 D15.C 23.75,34.5 24.75,33.5 28.25,33.5 K3.1 | 20.62,34.88 19.75,35.75 C51.2 | JP3.1 4,37.5 13.75,37.5 16.25,35 16.75,35 17,34.75 20.5,34.75 20.62,34.88 | 15,62 15,40.75 v6,40.75 | v6,93.5 6,107.75 12,113.75 12,114 | v9,195.75 9.75,195 11.25,195 13.5,192.75 v13.5,186.25
  Bottom 0.61: v176.75,183.5 176.75,189.5 174.75,191.5 K10.1 174.75,191.75 175.5,192.5 175.5,194 175.75,194.25 175.75,194.75 176,195 176,211 174.75,212.25 9.75,212.25 8.75,211.25 8.75,196 v9,195.75 | v183,173.25 v183,176.75 | K4.1 19.5,112.5 19.5,114.75 9.75,124.5 9.75,181.5 10,181.75 10,184 10.25,184.25 K5.1 10.25,183 v13.5,186.25 | K2.1 12.5,76.25 20,68.75 20,66.25 23.5,62.75 23.5,60.5 K1.1 | v30.75,31 28.5,33.25 K3.1 | v6,40.75 4,38.75 4,37.75 JP3.1 | v6,93.5 5.75,93.25 v5.75,80.5
GND  (via drill 0.3, 0.5)
  Top 0.305: C44.1 4.5,119 6.25,119 R14.1 6.25,118.75 6.25,117.5 v6,117.5 | 10,69.5 11.25,69.5 R18.1 | 10,69.5 9.75,69.5 C46.1 10,69.5 | 19.25,7.5 C67.1 | v20,7.5 19.25,7.5 | v20,27 18.75,27 C47.1 | v4,91 5.25,91 C45.1 5.5,90.75 5.5,89.5 R6.1 | v8.5,149.5 7.25,149.5 C43.1 | v20,4.5 19.25,4.5 18.75,5 R22.1 | R1.1 19.5,30 19.75,30 | R10.1 7.25,151.75 8,152.5 v8.5,152.5 7.5,153.5 Q3.2 | v4,88.5 4.25,88.5 5.25,87.5 Q1.2 | 19.25,7.5 18.75,7.5 18.75,8.75 Q6.2 | 19.75,30 18.75,31 Q2.2 | 19.75,30 v20,30 | v13,68 13.5,68 13.5,69.25 Q5.2 | v8.5,117.5 8.25,117.5 8.25,118.75 Q4.2 | v10,68 10,69.5
  Top 0.406: C62.2 v52,1 | C63.2 v58,1 | C66.2 v60,1 | C68.2 v66,1 | C82.2 v68,1 | C81.2 v72,1 | C25.2 v77,1 | C26.2 v81,1 | C22.2 v85,1 | C23.2 v91,1 | C24.2 v93,1
  other vias: 75.5,2 75.5,3 75.5,1 96.5,3 96.5,2 96.5,1 50.5,3 50.5,2 50.5,1 54,1 56,1 62,1 64,1 70,1 74,1 79,1 83,1 87,1 89,1 95,1 109.75,2.75 109.75,1.75 109.75,1 110.75,1 113,1 116,1 118,1 119.75,1 122.25,1 124,1 126,1 128,1 130.25,1 132,1 134,1 136,1 138,1 139.25,1 139.25,1.75 139.25,2.5 53.5,24.5 53.5,23.5 54.5,22.5 57,22.5 58.5,22.5 61,22.5 62.5,22.5 67.5,22.5 69.5,22.5 71,22.5 73,22.5 74.5,22.5 77,22.5 79.5,22.5 82,22.5 78.5,23 78.5,24.5 84,22.5 86,22.5 88,22.5 90,22.5 92,22.5 94,22.5 96,22.5 98,22.5 99.5,22.5 106.5,22.5 107.5,23 107.5,24.5 108.5,22.5 111,22.5 113,22.5 115,22.5 117,22.5 119,22.5 121,22.5 123,22.5 125,22.5 127,22.5 129,22.5 131,22.5 132.5,23 132.5,24 132.5,25 53.5,53 53.5,52 53.5,50.5 54.5,50.5 57,50.5 58.5,50.5 61,50.5 62.5,50.5 65,50.5 66.5,50.5 69,50.5 70.5,50.5 73,50.5 74.5,50.5 76.5,50.5 78.5,51 78.5,52 78.5,53 79.5,51.5 82,51.5 83.5,51.5 86,51.5 88,51.5 90,51.5 91.5,50.5 94,50.5 95.5,50 98,50 99.5,50 102,50 103.5,50 105.5,50 112,50.5 114.5,50.5 116.5,50.5 118.5,50.5 120,50.5 122.5,50.5 124,50.5 126,50.5 128,50.5 130.5,50.5 132.5,50.5 134.5,50.5 136,50.5 136,51.5 136,52.5 107.5,50.5 107.5,51.5 107.5,52.5 111,51 111,52 111,53 54.5,80 54.5,81 54.5,82 55.5,79.5 58,79.5 60,79.5 62,79.5 63.5,79.5 66.5,79.5 67.5,79.5 70.5,79.5 71.5,79.5 74,79.5 75.5,79.5 78,79.5 79.5,79.5 79.5,80.5 79.5,81.5 81,79.5 82,79.5 83,79.5 84.5,79.5 87,79.5 88.5,79.5 91,79.5 93,79.5 94.5,79.5 97,79.5 99,79.5 101,80.5 103,80.5 104.5,80.5 108.5,81 108.5,82 108.5,83 109.5,80.5 112,80.5 113.5,80.5 116,80.5 117.5,79.5 120,79.5 122.5,78.5 124,78.5 126,78.5 128,78.5 130,78.5 132,78.5 133.5,78.5 133.5,79.5 133.5,80.5 11,65 11,59.5 11.5,53.5 11.5,46.5 8,33.5 10.5,33.5 3.5,33.5 4,25 15,13 14,22 9.5,20 26,31.5 28,29.5 27.5,24 14,209 20,209 28,209 40,209 88,209 98,209 14,203 20,203 30,203 40,203 52,203 62,203 72,203 88,203 98,203 112,203 14,197 20,197 46,197 52,197 62,197 72,197 80,197 86,197 98,197 112,197 16,189 20,189 40,189 46,189 52,189 58,189 72,189 80,189 86,189 98,189 112,189 104,193 16,181 16,173 16,165 12,159 12,167 12,177 26,181 26,177 10,81 40,179 34,173 26,165 18,155 34,165 34,159 26,153 26,145 28,139 36,141 36,133 28,135 30,125 26,127 20,131 20,135 24,137 44,129 48,123 42,137 54,137 64,137 72,137 80,137 86,135 86,129 78,129 72,129 72,121 70,117 64,123 64,129 54,129 40,147 44,147 46,151 46,159 48,163 52,165 62,165 72,165 82,165 88,169 84,173 76,173 68,173 60,173 52,173 46,173 42,173 40,165 38,159 56,159 64,157 72,155 72,149 66,147 60,151 92,159 96,167 98,173 106,173 114,173 122,173 128,173 136,173 96,147 100,151 102,157 106,161 110,163 116,165 126,165 134,165 140,165 116,157 122,157 126,153 124,147 118,147 114,151 78,181 50,181 108,181 80,151 56,143 94,141 110,143 134,141 138,149 124,203 134,203 144,203 146,207 156,209 150,205 140,197 140,189 166,207 166,197 164,189 166,181 160,179 166,175 166,169 164,163 160,159 148,161 150,171 146,177 134,187 160,151 158,143 158,137 156,123 156,115 162,127 168,131 166,137 148,131 148,139 138,127 134,123 132,117 136,137 128,139 118,137 108,137 100,137 98,133 100,129 108,129 112,129 112,121 114,117 118,115 120,109 124,109 126,113 126,119 124,123 120,123 120,129 128,129 140,129 174,209 174,199 176,177 176,163 178,157 180,147 176,145 170,145 168,151 172,159 178,127 178,135 176,121 170,123 162,117 162,111 172,171 134,181 130,195 6,139 6,125 12,109 10,103 10,91 14,93 20,91 24,89 24,85 24,79 24,73 18,85 14,101 18,99 24,97 26,101 32,103 36,103 36,107 44,107 44,103 44,93 40,91 50,89 52,85 52,103 58,99 60,91 66,89 74,89 82,89 94,89 102,89 104,93 98,93 90,93 80,93 72,93 68,97 68,103 76,103 84,103 94,103 104,103 112,103 118,99 112,91 114,89 120,89 126,89 128,95 128,101 136,103 144,103 142,107 130,105 104,111 102,119 82,119 78,111 56,109 56,121 50,93 42,83 42,75 46,73 46,71 54,75 66,75 66,71 60,69 54,67 52,63 52,59 50,55 48,55 48,51 48,47 40,55 40,49 36,57 34,63 32,69 28,65 32,51 32,43 40,41 48,83 28,109 12,129 18,141 22,107 58,59 66,59 70,59 78,59 84,61 90,61 98,59 102,59 106,63 112,61 116,59 124,59 130,59 136,59 138,55 124,65 124,69 120,73 114,77 102,77 106,73 110,69 114,65 98,63 98,69 94,73 88,71 90,67 78,65 78,71 74,73 70,69 70,63 84,73 144,73 134,73 144,79 144,87 146,93 138,91 136,85 152,103 152,107 160,99 170,101 174,103 174,109 164,105 162,83 162,77 162,71 156,71 158,69 176,93 170,91 162,89 156,63 154,57 150,55 150,49 148,41 148,33 146,29 138,29 132,31 130,35 124,41 120,47 116,33 110,39 112,45 134,47 140,47 142,55 110,33 94,33 102,37 102,43 94,43 90,39 148,23 148,15 148,9 140,23 130,19 122,17 122,11 130,11 112,11 104,11 104,15 98,15 98,19 92,19 88,17 88,11 92,9 84,9 76,9 80,13 80,19 76,19 172,55 168,45 164,51 156,35 156,25 154,15 162,15 160,7 168,3 184,23 184,13 6,3 4,11 2,19 10,11 24,3 34,3 34,13 38,11 38,17 40,21 42,27 50,25 50,29 58,31 60,33 62,37 58,41 54,45 46,45 40,45 40,37 40,31 68,31 64,31 68,39 72,43 76,47 76,31 82,31 78,35 82,39 86,43 90,47 18,75 28,57 18,57 18,41 26,45 182,113 182,101 182,85 166,83 166,73 174,71 184,71 182,51 172,41 184,45 184,29 170,17 162,21 162,31 176,37 176,29 180,61 185,214 185,195 179.5,214.5 2,216 2,194.5 2,201 9,113.5 5.5,110 5.75,175.5 5.75,160.5
  pour Bottom (isolate 0.8, no thermals): 0,218 187,218 187,0 0,0
  pour Top (isolate 1, no thermals): 0,218 187,218 187,0 0,0
N$1
  Bottom 3.5: K12.O1 K12.O0 K6.P1 K6.P0
N$2
  Bottom 3.5: K3.S1 53.45,37 | 53.45,37 K3.S0 | L1.P$1 53.45,37
N$3
  Bottom 2.54: K3.O0 K3.O1 K1.P0 K1.P1
N$4
  Top 2.54: C80.1 C79.1 C75.1 C76.1 124,28.05 | 124,28.05 C77.1 C78.1 | L11.P$1 124,28.05
  Bottom 4: L3.P$2 L11.P$1
N$5
  Bottom 2.54: K1.S0 K1.S1 L5.P$1
N$6
  Bottom 3.5: K1.O0 K1.O1 K2.P0 K2.P1
N$7
  Top 2.54: C61.1 C60.1 | C60.1 C1.1 C2.1 C3.1 C27.1 C28.1 | L2.P$2 C60.1
  Bottom 4: L3.P$1 L2.P$2
N$8
  Top 2.54: K2.S1 35.5,88.5 L9.P$1
  Bottom 3.5: K2.S0 K2.S1
N$9
  Bottom 3.5: K2.O0 K2.O1 27.5,83.81 27.5,87.5 39.5,96 K4.P0 K4.P1
N$10
  Top 3.5: K8.S0 150.5,89.5 L4.P$2
  Bottom 3.5: K8.S1 K8.S0
N$11
  Bottom 3.5: K4.O0 K4.O1 29.5,157.5 K5.P0 arc4 K5.P1
N$12  (1 unrouted)
  Top 2.54: 57,86.5 C111.1 C110.1 C106.1 C107.1 C108.1 C109.1
  Top 4: L9.P$2 L7.1 57,86.5 57.5,86
N$13
  Bottom 3.5: K7.S1 K7.S0 L8.P$2
N$14  (via drill 0.3)
  Top 0.305: v185.25,76.5 185.25,50 168.25,33 R4.1 | v184,77.75 184,169.75 v184.25,169.75 | v5.5,195.75 6,195.25 7.25,195.25 8,194.5 8,193 v8.5,193 | v3.25,74.25 3.25,65 5.25,65 6.25,64 6.25,62.25 3,62.25 2.25,61.5 2.25,40 13.75,40 17.25,36.5 | 17.25,36.5 17.75,36 R2.1 | v16.5,34 17.25,34 17.75,33.5 Q2.3 | v16.5,36 17,36.5 17.25,36.5
  Bottom 0.305: v184,77.75 v185.25,76.5 | v184.25,169.75 179,175 179,211.25 175,215.25 5.5,215.25 v5.5,195.75 | v8.5,193 8.5,181.25 3.25,176 3.17,96.98 1,94.5 1,87 3.25,84.75 v3.25,74.25 | v16.5,36 v16.5,34
N$15
  Bottom 3.5: L11.P$2 K6.S0 K6.S1
N$17
  Bottom 3.5: K6.O1 K6.O0 K7.P1 K7.P0
N$18
  Bottom 2.54: K7.O0 K8.P1
  Bottom 3.5: K7.O1 K7.O0 | K8.P1 K8.P0
N$19
  Bottom 3.5: K8.O1 K8.O0 148.5,96 K9.P1 K9.P0
N$20
  Bottom 3.5: K10.P0 K10.P1 155,152 K9.O0 K9.O1
N$21
  Top 0.305: R3.1 15,27.25 16.75,27.25 C47.2 17,27.25 17,29 R1.2 17,29.25 17,31 Q2.1
N$22
  Top 2.54: C95.1 C94.1 62,56.05 | C93.1 74,56.05 | 74,56.05 C92.1 68.5,56 C91.1 C90.1 62,56.05 | L5.P$2 62,56.05 | L19.P$1 74,56.05
N$23
  Top 2.54: C89.1 C88.1 C4.1 C5.1 94.91,55.81 | 94.91,55.81 C6.1 C86.1 C87.1 L6.P$1 | L19.P$2 94.91,55.81
N$24
  Top 2.54: C101.1 C100.1 119.49,56.02 | 119.49,56.02 120.5,56 C96.1 C97.1 C98.1 C99.1 | L8.P$1 119.49,56.02
  Bottom 2.54: L6.P$2 L8.P$1
N$25
  Bottom 3.5: K5.O0 K5.O1 25.47,198.5 | C18.1 41,198.5 25.47,198.5 | L20.1 25.47,198.5
N$26  (2 unrouted)
  Top 2.54: C105.1 C104.1 C7.1 93.5,85 C8.1 C9.1 C102.1 C103.1 arc-73 105,87
  Top 3.5: L10.1 105,87
  Bottom 4: L7.2 L10.1
N$27  (1 unrouted)
  Top 2.54: 130.5,85.5 C115.1 C114.1 C113.1 C112.1 C116.1 114.5,86 C117.1
  Top 4: 130.5,85.5 L10.2 L4.P$1
N$28
  Top 3.5: K4.S1 42.5,124.5 L13.1
  Bottom 2.54: 44.45,119 K4.S1
  Bottom 3.5: K4.S0 44.45,119 C10.1
N$29
  Bottom 3.5: C11.1 68,133
  Bottom 4: L14.1 68,133 L13.2
N$30
  Bottom 2.54: 117,119.5 C12.1
  Bottom 3.5: L14.2 116.67,133 116.84,133.18 117,119.5
  Bottom 4: L15.1 L14.2
N$31
  Top 3.5: K9.S0 140.5,122.5 L15.2
  Bottom 3.5: K9.S1 K9.S0 C13.1
N$32
  Top 3.5: L16.1 35,180 K5.S0
  Bottom 3.5: K5.S0 K5.S1 | C14.1 L16.1
N$33
  Bottom 2.54: 43.5,169 L16.2
  Bottom 4: L17.1 L16.2 C15.1
N$34
  Bottom 4: L18.1 L17.2 C16.1
N$35
  Top 4: C17.1 L18.2 150,179 K10.S1
  Bottom 3.5: K10.S1 K10.S0
N$36
  Bottom 3.5: K11.O0 K11.O1 K3.P0 K3.P1
N$37
  Bottom 4: L20.2 67.5,207 | 67.5,207 L21.1 | C19.1 67.5,207
N$38
  Bottom 4: L21.2 117.5,207 | 117.5,207 L22.1 | C20.1 117.5,207
N$40  (via drill 0.3)
  Top 0.305: Q1.3 6.25,85.25 3.25,85.25 R5.1 3,85.25 1.75,85.25 v1.75,174 | v185.25,175.25 185.25,77.75 179.25,71.75 R8.1 | v181.25,185.25 181.25,185.75 176.75,190.25 176.75,193.25 180.5,193.25 182,194.75 v182,209.75 | v7,183.25 7.75,183.25 9.25,181.75 12,181.75 12,185.75 9.75,188 9,188 9,191.25 6.75,193.5 6.5,193.5 6.25,193.75 3.75,193.75 3.25,194.25 v3.25,208.25
  Bottom 0.305: v185.25,175.25 184,176.5 184,184.25 183,185.25 v181.25,185.25 | v182,209.75 175,216.75 3.5,217 3.25,216.75 v3.25,208.25 | v7,183.25 1.75,178 v1.75,174
N$41
  Top 0.305: R7.1 7,92.5 7,91 C45.2 7.25,90.75 7.25,89.5 R6.2 7.25,89.25 7.25,87.5 Q1.1
N$42  (via drill 0.3)
  Top 0.305: v178,194 177.75,194.25 173,194.25 173,182.75 176,179.75 181.5,179.75 181.5,176.75 184,174.25 R12.1 | v6.25,192.75 6.25,192 7,191.25 v7,186.5 | v4.5,183.5 4.5,177.5 3.5,177.5 2.25,176.25 R9.1 2.25,176 3.25,176 3.25,159 6.25,156 Q3.3
  Bottom 0.305: v178,194 178.25,194.25 178.25,211.25 175,214.5 6.25,214.5 v6.25,192.75 | v7,186.5 4.5,184 v4.5,183.5
N$43
  Top 0.305: R11.1 7,147.25 5.5,148.75 5.5,149.5 C43.2 5.5,149.75 R10.2 5.5,153.5 Q3.1
N$44  (via drill 0.3)
  Top 0.305: 11,120 10.75,120 Q4.3 11,120 | 11,120 12,120 13,121 R13.1 | v176.75,115.25 175.5,114 175.25,114 175,113.75 R16.1 | v176.75,117.75 181.5,122.5 v181.5,158 | v8.75,194.75 9.25,194.25 11,194.25 12.75,192.5 12.75,180 v8.5,180 | v7.75,122.25 8.25,121.75 9.25,121.75 11,120
  Bottom 0.305: v176.75,117.75 v176.75,115.25 | v181.5,158 177.5,162 177.5,190.5 176.5,191.5 176.5,194.5 176.75,194.75 176.75,211.25 175,213 9.5,213 8,211.5 8,195.5 v8.75,194.75 | v8.5,180 7.75,179.25 v7.75,122.25
N$45
  Top 0.305: R15.1 4.25,117 3.25,118 3.25,120.5 4.25,120.5 C44.2 4.5,120.75 6.25,120.75 R14.2 6.5,120.75 8.25,120.75 Q4.1
N$46  (via drill 0.3)
  Top 0.305: 16.25,70.5 15.75,70.5 Q5.3 16.25,70.5 | 16.25,70.5 18,70.5 R17.1 | v178,114 178.25,114 178.25,86.75 177.75,86.25 164,86.25 164,58.75 165,57.75 172.25,57.75 174,59.5 R20.1 | v178,117.75 182.25,122 182.25,173.5 v181.75,173.5 | v4.5,195.75 4.5,194.5 6.75,194.5 v7,194.25 | v1.5,179.5 1.5,178.75 1,178.25 1,75 10.75,75 13.5,72.25 14.5,72.25 16.25,70.5
  Bottom 0.305: v178,117.75 v178,114 | v181.75,173.5 179.75,175.5 179.75,211.25 175,216 4.5,216 v4.5,195.75 | v7,194.25 7,188.25 1.5,182.75 v1.5,179.5
N$47
  Top 0.305: R19.1 9.25,73.5 9.25,71.5 9.5,71.5 C46.2 9.75,71.25 11.25,71.25 R18.2 11.5,71.5 13.5,71.5 Q5.1
N$48  (via drill 0.3)
  Top 0.305: v4.45,93.17 4.75,92.25 5,92.5 R7.2
  Bottom 0.305: v4.45,93.17 4.5,92.5 5,92 5,66 6.5,64.5 6.5,64.25 6.75,64 6.75,58 5,56.25 4.25,56.25 JP7.5
N$49  (via drill 0.3)
  Top 0.305: v4,87 3.25,87 3.25,93.75 3.5,94 4.25,94.5 4.25,115 R15.2
  Bottom 0.305: v4,87 4,66.5 1.75,64.25 1.75,60.25 3.25,58.75 4,58.75 JP7.6
N$50  (via drill 0.3)
  Top 0.305: R11.2 5.5,142.5 3.75,142.5 3.5,142.25 3.5,122 v4.25,122 | v7.5,61.75 7,61.25 4.25,61.25 JP7.7
  Bottom 0.305: v4.25,122 7.25,119 7.25,64.25 7.5,64 v7.5,61.75
N$51
  Top 2.54: C25.1 C26.1 C22.1 C23.1 C24.1 101.97,5.56 | 101.97,5.56 L23.P$1 | C85.1 101.97,5.56
  Bottom 4: L12.P$2 L23.P$1
N$52
  Bottom 3.5: K10.O1 K10.O0 160.5,193
  Bottom 4: 160.5,193 L22.2 147,198.5 C21.1
N$53
  Top 2.54: C74.1 C73.1 C69.1 C70.1 C71.1 72.5,28.05 | 72.5,28.05 C72.1 | L1.P$2 72.5,28.05
  Bottom 4: L2.P$1 L1.P$2
N$54
  Bottom 3.5: C34.1 C13.2
N$55
  Bottom 3.5: C42.1 C21.2
N$56
  Bottom 3.5: C41.1 C20.2
N$57
  Bottom 3.5: C40.1 C19.2
N$58
  Bottom 3.5: C39.1 C18.2
N$61
  Bottom 3.5: C31.1 C10.2
N$62
  Bottom 3.5: C32.1 C11.2
N$63
  Bottom 3.5: C33.1 C12.2
N$64
  Bottom 4: C17.2 C38.1
N$65
  Bottom 4: C16.2 C37.1
N$66
  Bottom 4: C15.2 C36.1
N$67
  Bottom 4: C14.2 C35.1
N$72
  Top 0.305: R19.2 7.5,73.5 7.5,62.5 8,62.5 8.25,62.25 8.25,53.5 4.25,53.5 JP7.4
N$73  (via drill 0.3)
  Top 0.305: v13,36.5 13,27.25 R3.2
  Bottom 0.305: v13,36.5 6.75,42.75 6.75,49 5,50.75 4.25,50.75 JP7.3
N$74
  Bottom 3.5: K11.P1 K11.P0 JP1.1
N$75
  Bottom 3.5: K11.S0 53.45,15 | 53.45,15 K11.S1 | L24.P$1 53.45,15
N$76  (via drill 0.3)
  Top 0.305: Q6.3 17.75,11.25 17.75,13.5 R21.1 17.75,13.75 16.75,13.75 16.75,16 22,21.25 30,21.25 30,58 v21,67 | v177.5,191.75 179.75,191.75 179.75,188.75 182.5,186 186,186 186,28.25 168,10.25 R24.1 | v2.5,174.75 2.5,86.25 13,86.25 21,78.25 v21,68.5
  Bottom 0.305: v177.5,191.75 177.25,192 177.25,194.5 177.5,194.75 177.5,211.25 175,213.75 9.25,213.75 9.25,213.5 7.25,211.5 7.25,195.25 7.75,194.75 7.75,181.25 2.5,176 v2.5,174.75 | v21,67 v21,68.5
N$77
  Top 2.54: C62.1 C63.1 C66.1 C68.1 C82.1 C81.1
  Top 3.5: L24.P$2 C68.1
  Bottom 4: L12.P$1 L24.P$2
N$79
  Top 2.54: C83.1 C84.1 126,6 C29.1 C30.1 C58.1 C59.1
  Top 3.5: L25.P$1 C83.1
  Bottom 4: L23.P$2 L25.P$1
N$80
  Bottom 3.5: K12.S1 134.55,15 | 134.55,15 K12.S0 | L25.P$2 134.55,15
N$81
  Bottom 3.5: K12.P0 K12.P1 139.55,7.41 JP5.1
N$82
  Top 0.305: R23.1 15.25,8.75 16.75,8.75 Q6.1 17,8.75 17,7 C67.2 17,6.75 17,5 R22.2
N$86
  Top 0.305: R23.2 15,10.5 1.5,24 1.5,63.5 4,63.5 JP7.8
R1
  Top 0.305: 3.75,82.25 3.75,83.5 3.25,83.5 R5.2 | 3.75,82.25 3.75,81.25 C50.1 | 3.75,82.25 7.25,82.25 D2.A 7.5,82.25 9,83.75 12.25,83.75 K2.2
R2
  Top 0.305: R2.2 18,37.75 19.5,37.75 C51.1 19.75,37.75 20.75,38.75 23.25,38.75 D15.A 23.5,39 26.5,39 28.25,40.75 K3.2
R3
  Top 0.305: C52.1 14,65 15.25,66.25 17.75,66.25 D1.A 18,66.5 19.75,66.5 19.75,67.75 | 19.75,67.75 19.75,70.25 R17.2 | 19.75,67.75 23.25,67.75 K1.2
R4
  Top 0.305: R21.2 18,15.5 19.5,15.5 C65.1 19.75,15.5 21.25,17 23,17 D11.A 23.25,17.25 26.75,17.25 28.25,18.75 K11.2
R5
  Top 0.305: C49.1 11,117 12,118 13.75,118 D3.A 14,118.25 14.75,118.25 14.75,119.75 | 14.75,119.75 14.75,121 R13.2 | 14.75,119.75 19.25,119.75 K4.2
R8  (via drill 0.3)
  Top 0.305: R9.2 2.25,177.75 2.25,181.25 D4.A 2.25,181.5 3.5,181.5 3.5,184.5 C48.1 3.75,184.75 4.75,185.75 7.75,185.75 v9.25,187.25
  Bottom 0.305: v9.25,187.25 9.25,188.25 10.25,189.25 10.25,191.75 K5.2
RB6
  Top 0.305: R24.2 168,13 | 168,13 C64.2 | 168,13 165,13 D10.A 165,12.75 163.5,11.25 159.75,11.25 K12.2
RB10
  Top 0.305: 168,36 168,34.75 R4.2 | 168,36 C57.2 | 168,36 165,36 D5.A 165,35.75 163.5,34.25 159.75,34.25 K6.2
RB15
  Top 0.305: 174,62 174,61.5 R20.2 | 174,62 C56.2 | 174,62 171,62 D6.A 171,61.75 169.5,60.25 165.75,60.25 K7.2
RB20
  Top 0.305: C55.2 182.5,77 179,77 D7.A 179,75.25 | 179,75.25 179,73.25 R8.2 | 179,75.25 173.75,75.25 K8.2
RB40
  Top 0.305: 172.25,114.5 171.75,114.5 171.5,114.25 D8.A | 172.25,114.5 174.5,114.5 175,115 C54.2 | 172.25,114.5 174.75,112 R16.2 | 172.25,114.5 D8.A | D8.A 171.25,114 169.5,112.25 165.75,112.25 K9.2
RB80
  Top 0.305: 184.75,178.5 184.75,176 184.25,176 R12.2 | 184.75,178.5 184.75,182.25 184,182.25 D9.A 183.75,182.5 182,184.25 174.75,184.25 K10.2 | 184.75,178.5 C53.2

### Text on the board
tPlace: FID2 | 6m | 80x160 | 6040 | 3020 | 1715 | 1210 | --- | GND | +12V | 2kW LP-Filter V2 / DJ0ABR | GND | RF1 | RF2 | GND | FID1